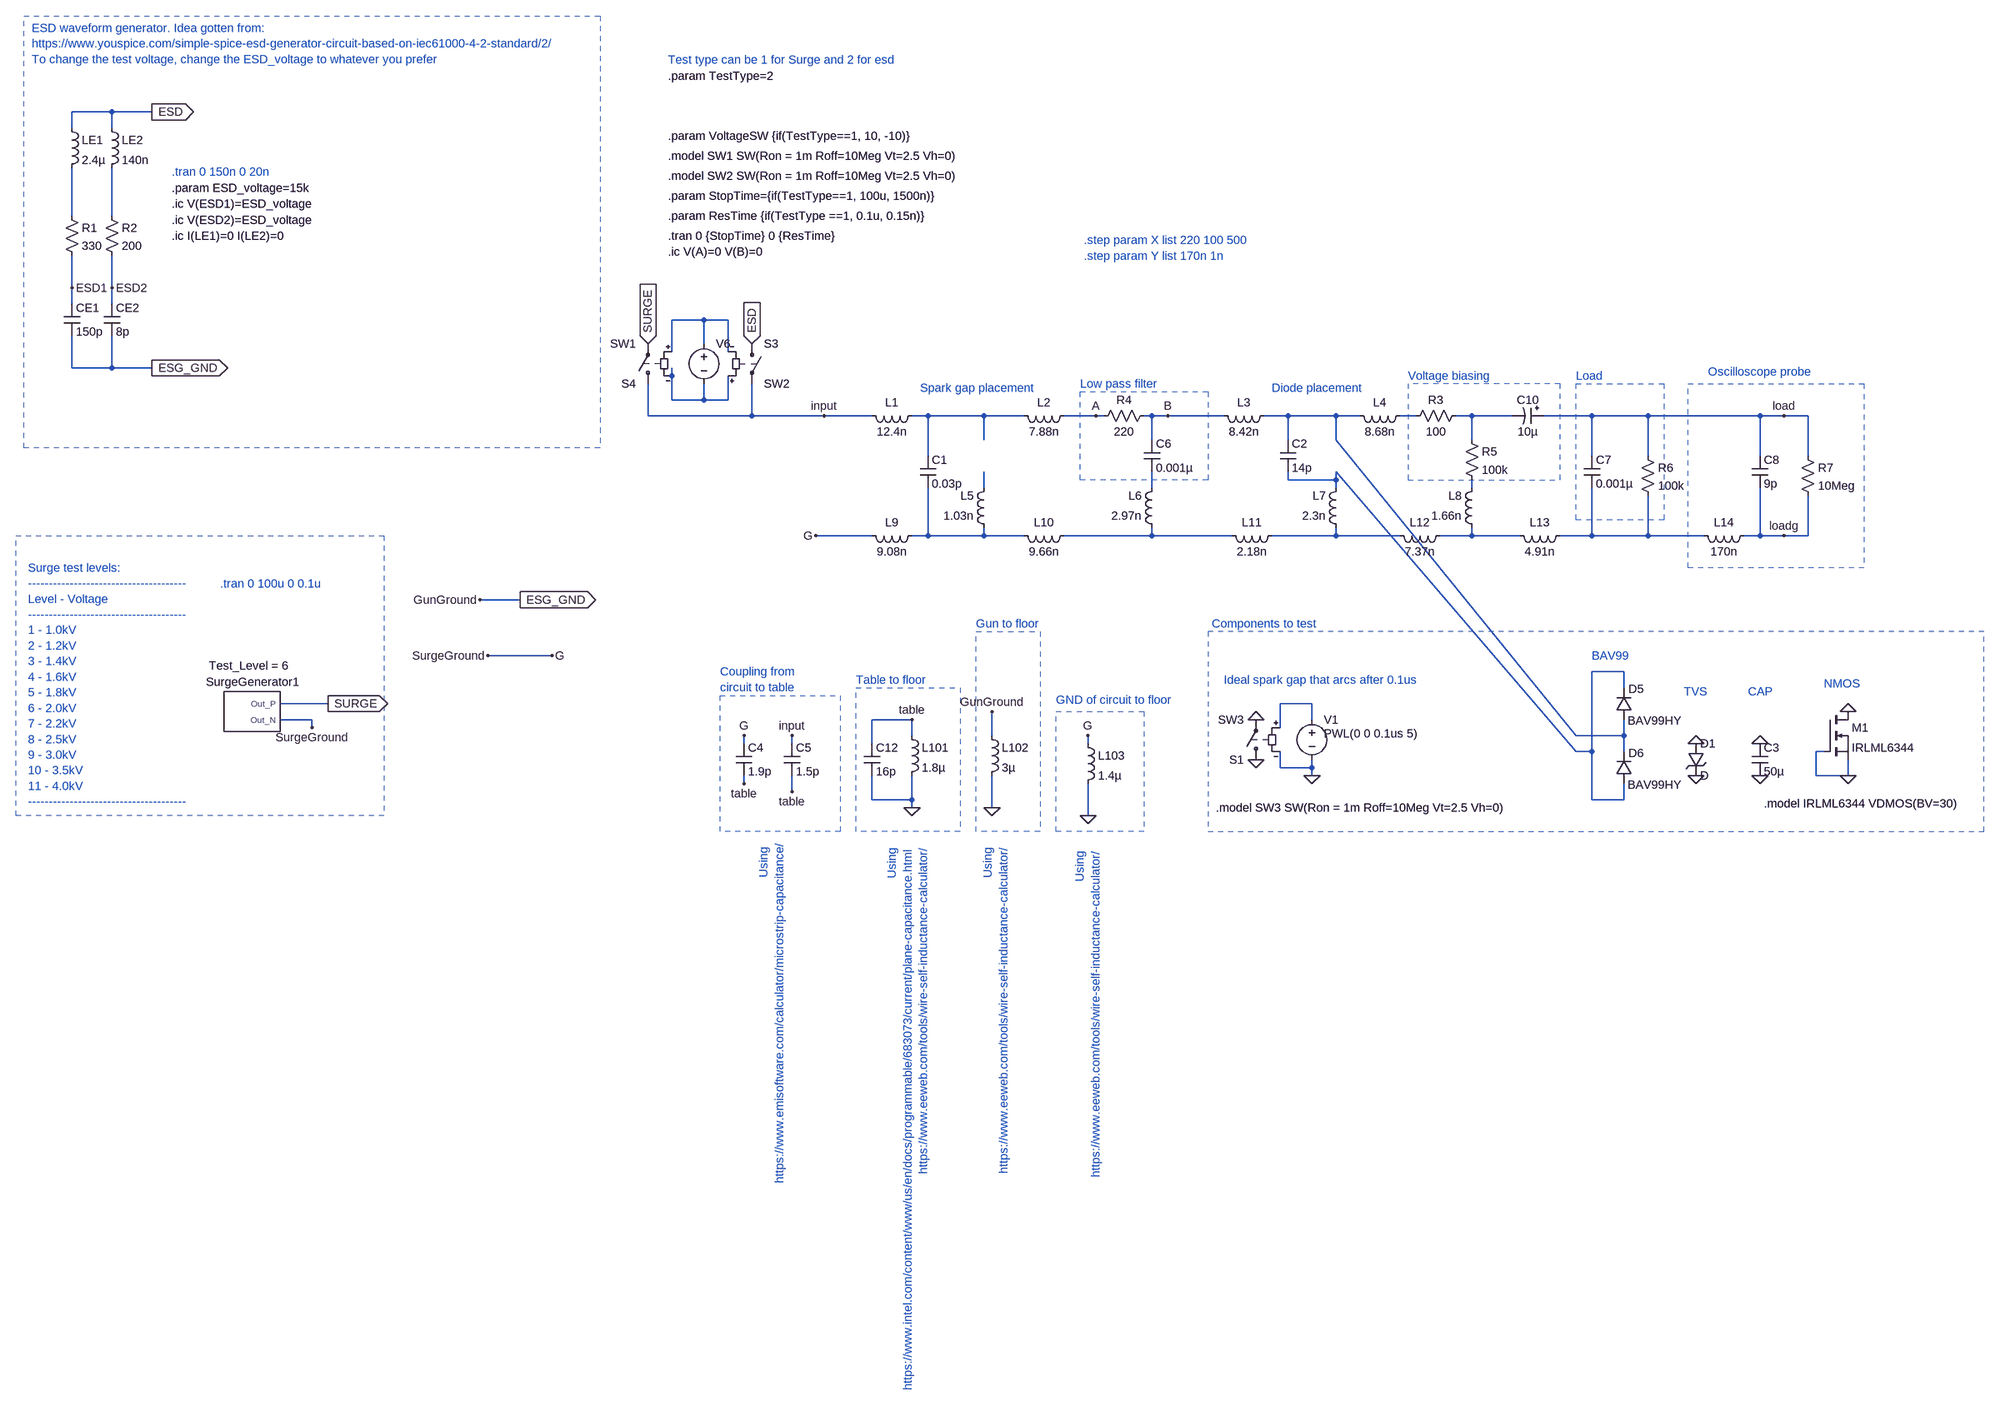
[diagram p0: schematic comparison.asc]
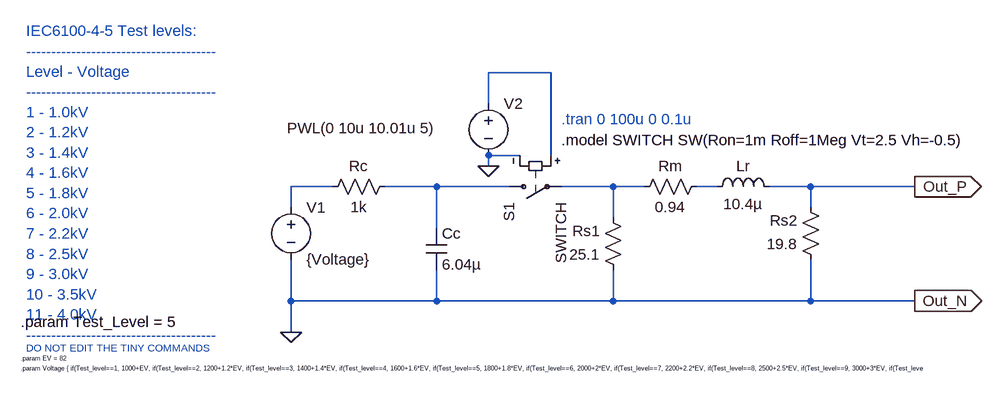
[diagram p1: sub-circuit surgetester.asc]
comparison.asc, the LTspice schematic file:
Version 4
SHEET 1 2900 2376
WIRE -848 -368 -928 -368
WIRE -768 -368 -848 -368
WIRE -928 -336 -928 -368
WIRE -848 -336 -848 -368
WIRE -928 -160 -928 -256
WIRE -848 -160 -848 -256
WIRE -928 -16 -928 -80
WIRE -848 -16 -848 -80
WIRE -928 16 -928 -16
WIRE -848 16 -848 -16
WIRE 336 48 272 48
WIRE 384 48 336 48
WIRE 336 96 336 48
WIRE 272 112 272 48
WIRE 384 112 384 48
WIRE -928 144 -928 80
WIRE -848 144 -848 80
WIRE -848 144 -928 144
WIRE -768 144 -848 144
WIRE 272 160 272 144
WIRE 272 208 272 160
WIRE 336 208 336 176
WIRE 336 208 272 208
WIRE 384 208 384 160
WIRE 384 208 336 208
WIRE 224 240 224 176
WIRE 432 240 432 176
WIRE 432 240 224 240
WIRE 576 240 432 240
WIRE 672 240 576 240
WIRE 784 240 752 240
WIRE 896 240 784 240
WIRE 976 240 896 240
WIRE 1120 240 1056 240
WIRE 1136 240 1120 240
WIRE 1232 240 1216 240
WIRE 1264 240 1232 240
WIRE 1376 240 1264 240
WIRE 1504 240 1456 240
WIRE 1600 240 1504 240
WIRE 1648 240 1600 240
WIRE 1760 240 1728 240
WIRE 1872 240 1840 240
WIRE 1952 240 1872 240
WIRE 2112 240 2016 240
WIRE 2224 240 2112 240
WIRE 2448 240 2224 240
WIRE 2496 240 2448 240
WIRE 2544 240 2496 240
WIRE 896 288 896 240
WIRE 1232 288 1232 240
WIRE 1504 288 1504 240
WIRE 1600 288 1600 240
WIRE 1872 288 1872 240
WIRE 784 320 784 240
WIRE 2112 320 2112 240
WIRE 2224 320 2224 240
WIRE 2448 320 2448 240
WIRE 2544 320 2544 240
WIRE 1504 368 1504 352
WIRE 1600 368 1600 352
WIRE 1600 368 1504 368
WIRE 896 384 896 352
WIRE 1232 384 1232 352
WIRE 1600 384 1600 368
WIRE 1872 384 1872 368
WIRE 672 480 560 480
WIRE 784 480 784 384
WIRE 784 480 752 480
WIRE 896 480 896 464
WIRE 896 480 784 480
WIRE 976 480 896 480
WIRE 1232 480 1232 464
WIRE 1232 480 1056 480
WIRE 1392 480 1232 480
WIRE 1600 480 1600 464
WIRE 1600 480 1472 480
WIRE 1728 480 1600 480
WIRE 1872 480 1872 464
WIRE 1872 480 1808 480
WIRE 1968 480 1872 480
WIRE 2112 480 2112 384
WIRE 2112 480 2048 480
WIRE 2224 480 2224 400
WIRE 2224 480 2112 480
WIRE 2336 480 2224 480
WIRE 2448 480 2448 384
WIRE 2448 480 2416 480
WIRE 2496 480 2448 480
WIRE 2544 480 2544 400
WIRE 2544 480 2496 480
WIRE -32 608 -112 608
WIRE 32 720 -96 720
WIRE 2176 752 2112 752
WIRE 2176 784 2176 752
WIRE -416 816 -512 816
WIRE 1552 816 1488 816
WIRE -448 848 -512 848
WIRE 752 848 672 848
WIRE 1552 848 1552 816
WIRE -448 864 -448 848
WIRE 1488 864 1488 816
WIRE 752 880 752 848
WIRE 912 880 912 832
WIRE 2080 880 1600 288
WIRE 2176 880 2176 848
WIRE 2176 880 2080 880
WIRE 416 896 416 880
WIRE 512 896 512 880
WIRE 672 896 672 848
WIRE 1104 896 1104 880
WIRE 2080 912 1600 352
WIRE 2112 912 2112 752
WIRE 2112 912 2080 912
WIRE 2176 912 2176 880
WIRE 2576 912 2560 912
WIRE 1488 944 1488 912
WIRE 1552 944 1552 928
WIRE 1552 944 1488 944
WIRE 1552 960 1552 944
WIRE 2560 960 2560 912
WIRE 2624 960 2624 928
WIRE 2624 960 2560 960
WIRE 416 976 416 960
WIRE 512 992 512 960
WIRE 672 1008 672 960
WIRE 752 1008 752 960
WIRE 752 1008 672 1008
WIRE 2112 1008 2112 912
WIRE 2176 1008 2176 976
WIRE 2176 1008 2112 1008
WIRE 752 1024 752 1008
WIRE 912 1024 912 960
WIRE 1104 1040 1104 976
FLAG -768 -368 ESD
IOPIN -768 -368 Out
FLAG -928 -16 ESD1
FLAG -848 -16 ESD2
FLAG -416 816 SURGE
IOPIN -416 816 Out
FLAG 912 832 GunGround
FLAG 416 880 G
FLAG 432 96 ESD
IOPIN 432 96 In
FLAG 1120 240 A
FLAG 1264 240 B
FLAG 2496 240 load
FLAG 224 96 SURGE
IOPIN 224 96 In
FLAG -448 864 SurgeGround
FLAG 512 992 table
FLAG 416 976 table
FLAG 1104 880 G
FLAG 752 848 table
FLAG 912 1024 0
FLAG 1104 1040 0
FLAG 752 1024 0
FLAG -768 144 ESG_GND
IOPIN -768 144 Out
FLAG -32 608 ESG_GND
IOPIN -32 608 Out
FLAG -112 608 GunGround
FLAG 1552 960 0
FLAG 560 480 G
FLAG 2496 480 loadg
FLAG 2320 960 0
FLAG 2448 960 0
FLAG 2624 960 0
FLAG 2320 896 0
FLAG 2448 896 0
FLAG 2624 832 0
FLAG 1440 928 0
FLAG 1440 848 0
FLAG 576 240 input
FLAG 512 880 input
FLAG -96 720 SurgeGround
FLAG 32 720 G
SYMBOL cap -944 16 R0
SYMATTR InstName CE1
SYMATTR Value 150p
SYMBOL cap -864 16 R0
SYMATTR InstName CE2
SYMATTR Value 8p
SYMBOL res -944 -176 R0
SYMATTR InstName R1
SYMATTR Value 330
SYMBOL res -864 -176 R0
SYMATTR InstName R2
SYMATTR Value 200
SYMBOL ind -944 -352 R0
SYMATTR InstName LE1
SYMATTR Value 2.4µ
SYMBOL ind -864 -352 R0
SYMATTR InstName LE2
SYMATTR Value 140n
SYMBOL SurgeTester -576 832 R0
WINDOW 39 2 -76 Bottom 2
SYMATTR SpiceLine Test_Level = 6
SYMATTR InstName SurgeGenerator1
SYMBOL res 1120 256 R270
WINDOW 0 32 56 VTop 2
WINDOW 3 0 56 VBottom 2
SYMATTR InstName R4
SYMATTR Value 220
SYMATTR SpiceLine tol=1 pwr=100m
SYMBOL diode 2192 976 R180
WINDOW 0 -24 61 Left 2
WINDOW 3 -99 -2 Left 2
SYMATTR InstName D6
SYMATTR Value BAV99HY
SYMBOL cap 1216 288 R0
SYMATTR InstName C6
SYMATTR Value 0.001µ
SYMATTR SpiceLine V=50 Irms=0 Rser=0.2578 Lser=410p mfg="W�rth Elektronik" pn="885012206083R WCAP-CSGP 0603" type="X7R"
SYMBOL res 2208 304 R0
SYMATTR InstName R6
SYMATTR Value 100k
SYMBOL ind 768 224 R90
WINDOW 0 5 56 VBottom 2
WINDOW 3 32 56 VTop 2
SYMATTR InstName L1
SYMATTR Value 12.4n
SYMBOL ind 1472 224 R90
WINDOW 0 5 56 VBottom 2
WINDOW 3 32 56 VTop 2
SYMATTR InstName L3
SYMATTR Value 8.42n
SYMBOL cap 768 320 R0
SYMATTR InstName C1
SYMATTR Value 0.03p
SYMBOL cap 1488 288 R0
SYMATTR InstName C2
SYMATTR Value 14p
SYMBOL polcap 2016 224 R90
WINDOW 0 0 32 VBottom 2
WINDOW 3 32 32 VTop 2
SYMATTR InstName C10
SYMATTR Value 10µ
SYMBOL sw 432 80 R0
SYMATTR InstName S3
SYMATTR Value SW2
SYMBOL sw 224 192 R180
SYMATTR InstName S4
SYMATTR Value SW1
SYMBOL voltage 336 80 R0
WINDOW 3 24 96 Invisible 1
WINDOW 123 0 0 Left 0
WINDOW 39 0 0 Left 0
SYMATTR Value {VoltageSW}
SYMATTR InstName V6
SYMBOL diode 2192 848 R180
WINDOW 0 -24 61 Left 2
WINDOW 3 -99 -2 Left 2
SYMATTR InstName D5
SYMATTR Value BAV99HY
SYMBOL nmos 2576 832 R0
SYMATTR InstName M1
SYMATTR Value IRLML6344
SYMBOL TVSdiode 2304 896 R0
SYMATTR InstName D1
SYMBOL cap 2432 896 R0
SYMATTR InstName C3
SYMATTR Value 50µ
SYMBOL ind 1088 880 R0
SYMATTR InstName L103
SYMATTR Value 1.4µ
SYMATTR SpiceLine Rser=0.03
SYMBOL res 1856 224 R90
WINDOW 0 0 56 VBottom 2
WINDOW 3 32 56 VTop 2
SYMATTR InstName R3
SYMATTR Value 100
SYMBOL res 1856 272 R0
SYMATTR InstName R5
SYMATTR Value 100k
SYMBOL cap 2096 320 R0
SYMATTR InstName C7
SYMATTR Value 0.001µ
SYMATTR SpiceLine V=10 Irms=0 Rser=0.2496 Lser=404p mfg="W�rth Elektronik" pn="885012206008 WCAP-CSGP 0603" type="X7R"
SYMBOL cap 400 896 R0
SYMATTR InstName C4
SYMATTR Value 1.9p
SYMBOL ind 736 864 R0
SYMATTR InstName L101
SYMATTR Value 1.8µ
SYMATTR SpiceLine Rser=0.12
SYMBOL ind 896 864 R0
SYMATTR InstName L102
SYMATTR Value 3µ
SYMATTR SpiceLine Rser=0.081
SYMBOL cap 496 896 R0
SYMATTR InstName C5
SYMATTR Value 1.5p
SYMBOL cap 656 896 R0
SYMATTR InstName C12
SYMATTR Value 16p
SYMBOL sw 1440 944 R180
SYMATTR InstName S1
SYMATTR Value SW3
SYMBOL voltage 1552 832 R0
WINDOW 3 24 44 Left 2
WINDOW 123 0 0 Left 0
WINDOW 39 0 0 Left 0
SYMATTR Value PWL(0 0 0.1us 5)
SYMATTR InstName V1
SYMBOL ind 768 464 R90
WINDOW 0 5 56 VBottom 2
WINDOW 3 32 56 VTop 2
SYMATTR InstName L9
SYMATTR Value 9.08n
SYMBOL ind 1488 464 R90
WINDOW 0 5 56 VBottom 2
WINDOW 3 32 56 VTop 2
SYMATTR InstName L11
SYMATTR Value 2.18n
SYMBOL ind 2064 464 R90
WINDOW 0 5 56 VBottom 2
WINDOW 3 32 56 VTop 2
SYMATTR InstName L13
SYMATTR Value 4.91n
SYMBOL ind 1072 224 R90
WINDOW 0 5 56 VBottom 2
WINDOW 3 32 56 VTop 2
SYMATTR InstName L2
SYMATTR Value 7.88n
SYMBOL ind 1072 464 R90
WINDOW 0 5 56 VBottom 2
WINDOW 3 32 56 VTop 2
SYMATTR InstName L10
SYMATTR Value 9.66n
SYMBOL ind 912 480 R180
WINDOW 0 36 80 Left 2
WINDOW 3 36 40 Left 2
SYMATTR InstName L5
SYMATTR Value 1.03n
SYMBOL ind 1248 480 R180
WINDOW 0 36 80 Left 2
WINDOW 3 36 40 Left 2
SYMATTR InstName L6
SYMATTR Value 2.97n
SYMBOL ind 1616 480 R180
WINDOW 0 36 80 Left 2
WINDOW 3 36 40 Left 2
SYMATTR InstName L7
SYMATTR Value 2.3n
SYMBOL ind 1888 480 R180
WINDOW 0 36 80 Left 2
WINDOW 3 36 40 Left 2
SYMATTR InstName L8
SYMATTR Value 1.66n
SYMBOL ind 1824 464 R90
WINDOW 0 5 56 VBottom 2
WINDOW 3 32 56 VTop 2
SYMATTR InstName L12
SYMATTR Value 7.37n
SYMBOL ind 1744 224 R90
WINDOW 0 5 56 VBottom 2
WINDOW 3 32 56 VTop 2
SYMATTR InstName L4
SYMATTR Value 8.68n
SYMBOL cap 2432 320 R0
SYMATTR InstName C8
SYMATTR Value 9p
SYMBOL res 2528 304 R0
SYMATTR InstName R7
SYMATTR Value 10Meg
SYMBOL ind 2432 464 R90
WINDOW 0 5 56 VBottom 2
WINDOW 3 32 56 VTop 2
SYMATTR InstName L14
SYMATTR Value 170n
TEXT -728 -184 Left 2 !.ic V(ESD1)=ESD_voltage
TEXT -728 -248 Left 2 ;.tran 0 150n 0 20n
TEXT -728 -216 Left 2 !.param ESD_voltage=15k
TEXT -1008 -536 Left 2 ;ESD waveform generator. Idea gotten from:\nhttps://www.youspice.com/simple-spice-esd-generator-circuit-based-on-iec61000-4-2-standard/2/\nTo change the test voltage, change the ESD_voltage to whatever you prefer
TEXT -1016 544 Left 2 ;Surge test levels:\n--------------------------------------\nLevel - Voltage\n--------------------------------------\n1 - 1.0kV\n2 - 1.2kV\n3 - 1.4kV\n4 - 1.6kV\n5 - 1.8kV\n6 - 2.0kV\n7 - 2.2kV\n8 - 2.5kV\n9 - 3.0kV\n10 - 3.5kV\n11 - 4.0kV\n--------------------------------------
TEXT -632 576 Left 2 ;.tran 0 100u 0 0.1u
TEXT 264 -440 Left 2 !.param TestType=2
TEXT 264 -472 Left 2 ;Test type can be 1 for Surge and 2 for esd
TEXT 264 -320 Left 2 !.param VoltageSW {if(TestType==1, 10, -10)}
TEXT 264 -280 Left 2 !.model SW1 SW(Ron = 1m Roff=10Meg Vt=2.5 Vh=0)
TEXT 264 -240 Left 2 !.model SW2 SW(Ron = 1m Roff=10Meg Vt=2.5 Vh=0)
TEXT 264 -200 Left 2 !.param StopTime={if(TestType==1, 100u, 1500n)}
TEXT 264 -160 Left 2 !.param ResTime {if(TestType ==1, 0.1u, 0.15n)}
TEXT 264 -120 Left 2 !.tran 0 {StopTime} 0 {ResTime}
TEXT 1088 176 Left 2 ;Low pass filter
TEXT 768 184 Left 2 ;Spark gap placement
TEXT 2080 160 Left 2 ;Load
TEXT 2456 1016 Left 2 !.model IRLML6344 VDMOS(BV=30)
TEXT 264 -88 Left 2 !.ic V(A)=0 V(B)=0
TEXT 2344 152 Left 2 ;Oscilloscope probe
TEXT 368 752 Left 2 ;Coupling from \ncircuit to table
TEXT 640 768 Left 2 ;Table to floor
TEXT 880 656 Left 2 ;Gun to floor
TEXT 1040 808 Left 2 ;GND of circuit to floor
TEXT 1472 184 Left 2 ;Diode placement
TEXT 1096 -112 Left 2 ;.step param X list 220 100 500
TEXT -728 -120 Left 2 !.ic I(LE1)=0 I(LE2)=0
TEXT -728 -152 Left 2 !.ic V(ESD2)=ESD_voltage
TEXT 1360 1024 Left 2 !.model SW3 SW(Ron = 1m Roff=10Meg Vt=2.5 Vh=0)
TEXT 1744 160 Left 2 ;Voltage biasing
TEXT 1096 -80 Left 2 ;.step param Y list 170n 1n
TEXT 1352 656 Left 2 ;Components to test
TEXT 1376 768 Left 2 ;Ideal spark gap that arcs after 0.1us
TEXT 2112 720 Left 2 ;BAV99
TEXT 2296 792 Left 2 ;TVS
TEXT 2424 792 Left 2 ;CAP
TEXT 2576 776 Left 2 ;NMOS
TEXT 456 1096 VRight 2 ;Using \nhttps://www.emisoftware.com/calculator/microstrip-capacitance/
TEXT 712 1104 VRight 2 ;Using\nhttps://www.intel.com/content/www/us/en/docs/programmable/683073/current/plane-capacitance.html\nhttps://www.eeweb.com/tools/wire-self-inductance-calculator/
TEXT 904 1104 VRight 2 ;Using\nhttps://www.eeweb.com/tools/wire-self-inductance-calculator/
TEXT 1088 1112 VRight 2 ;Using\nhttps://www.eeweb.com/tools/wire-self-inductance-calculator/
RECTANGLE Normal 128 304 -1024 -560 2
RECTANGLE Normal -304 1040 -1040 480 2
RECTANGLE Normal 608 1072 368 800 2
RECTANGLE Normal 1216 1072 1040 832 2
RECTANGLE Normal 1008 1072 880 672 2
RECTANGLE Normal 1344 368 1088 192 2
RECTANGLE Normal 2080 176 2256 448 2
RECTANGLE Normal 1744 368 2048 176 2
RECTANGLE Normal 2656 544 2304 176 2
RECTANGLE Normal 2896 672 1344 1072 2
RECTANGLE Normal 848 1072 640 784 2

surgetester.asc, the sub-circuit schematic file:
Version 4
SHEET 1 4016 680
WIRE 336 -80 240 -80
WIRE 240 -32 240 -80
WIRE 288 48 240 48
WIRE 336 48 336 -80
WIRE 240 64 240 48
WIRE 0 96 -64 96
WIRE 160 96 80 96
WIRE 272 96 160 96
WIRE 432 96 352 96
WIRE 480 96 432 96
WIRE 592 96 560 96
WIRE 736 96 672 96
WIRE 896 96 736 96
WIRE -64 128 -64 96
WIRE 736 128 736 96
WIRE 432 144 432 96
WIRE 160 160 160 96
WIRE -64 272 -64 208
WIRE 160 272 160 224
WIRE 160 272 -64 272
WIRE 432 272 432 224
WIRE 432 272 160 272
WIRE 736 272 736 208
WIRE 736 272 432 272
WIRE 896 272 736 272
WIRE -64 320 -64 272
FLAG 240 64 0
FLAG -64 320 0
FLAG 896 96 Out_P
IOPIN 896 96 Out
FLAG 896 272 Out_N
IOPIN 896 272 Out
SYMBOL voltage -64 112 R0
WINDOW 123 0 0 Left 0
WINDOW 39 0 0 Left 0
SYMATTR InstName V1
SYMATTR Value {Voltage}
SYMBOL voltage 240 -48 R0
WINDOW 3 -310 54 Left 2
WINDOW 123 0 0 Left 0
WINDOW 39 0 0 Left 0
SYMATTR InstName V2
SYMATTR Value PWL(0 10u 10.01u 5)
SYMBOL res 96 80 R90
WINDOW 0 0 56 VBottom 2
WINDOW 3 32 56 VTop 2
SYMATTR InstName Rc
SYMATTR Value 1k
SYMBOL res 576 80 R90
WINDOW 0 0 56 VBottom 2
WINDOW 3 32 56 VTop 2
SYMATTR InstName Rm
SYMATTR Value 0.94
SYMBOL res 448 240 R180
WINDOW 0 36 76 Left 2
WINDOW 3 36 40 Left 2
SYMATTR InstName Rs1
SYMATTR Value 25.1
SYMBOL res 752 224 R180
WINDOW 0 36 76 Left 2
WINDOW 3 36 40 Left 2
SYMATTR InstName Rs2
SYMATTR Value 19.8
SYMBOL sw 256 96 M90
SYMATTR InstName S1
SYMATTR Value SWITCH
SYMBOL cap 144 160 R0
SYMATTR InstName Cc
SYMATTR Value 6.04µ
SYMBOL ind 576 112 R270
WINDOW 0 32 56 VTop 2
WINDOW 3 5 56 VBottom 2
SYMATTR InstName Lr
SYMATTR Value 10.4µ
TEXT 352 24 Left 2 !.model SWITCH SW(Ron=1m Roff=1Meg Vt=2.5 Vh=-0.5)
TEXT 352 -8 Left 2 ;.tran 0 100u 0 0.1u
TEXT -472 -144 Left 2 ;IEC6100-4-5 Test levels:\n--------------------------------------\nLevel - Voltage\n--------------------------------------\n1 - 1.0kV\n2 - 1.2kV\n3 - 1.4kV\n4 - 1.6kV\n5 - 1.8kV\n6 - 2.0kV\n7 - 2.2kV\n8 - 2.5kV\n9 - 3.0kV\n10 - 3.5kV\n11 - 4.0kV\n--------------------------------------
TEXT -480 304 Left 2 !.param Test_Level = 5
TEXT -480 376 Left 0 !.param Voltage { if(Test_level==1, 1000+EV, if(Test_level==2, 1200+1.2*EV, if(Test_level==3, 1400+1.4*EV, if(Test_level==4, 1600+1.6*EV, if(Test_level==5, 1800+1.8*EV, if(Test_level==6, 2000+2*EV, if(Test_level==7, 2200+2.2*EV, if(Test_level==8, 2500+2.5*EV, if(Test_level==9, 3000+3*EV, if(Test_level==10, 3500+3.5*EV, if(Test_level==11, 4000+4*EV, 0)))))))))))}
TEXT -480 360 Left 0 !.param EV = 82
TEXT -472 344 Left 1 ;DO NOT EDIT THE TINY COMMANDS

The netlist it stands for:
* comparison.asc
CE1 ESD1 ESG_GND 150p
CE2 ESD2 ESG_GND 8p
R1 N001 ESD1 330
R2 N002 ESD2 200
LE1 ESD N001 2.4µ
LE2 ESD N002 140n
XSurgeGenerator1 SurgeGround SURGE surgetester params: Test_Level = 6
R4 A B 220 tol=1 pwr=100m
D6 N009 N006 BAV99HY
C6 B N011 0.001µ V=50 Irms=0 Rser=0.2578 Lser=410p mfg="W�rth Elektronik" pn="885012206083R WCAP-CSGP 0603" type="X7R"
R6 load N017 100k
L1 N005 input 12.4n
L3 N006 B 8.42n
C1 N005 N013 0.03p
C2 N006 N009 14p
C10 load N008 10µ
S3 ESD input N004 N003 SW2
S4 input SURGE N003 N004 SW1
V6 N003 N004 {VoltageSW}
D5 N006 N009 BAV99HY
M1 0 0 0 0 IRLML6344
D1 0 0 D
C3 0 0 50µ
L103 SurgeGround 0 1.4µ Rser=0.03
R3 N008 N007 100
R5 N008 N012 100k
C7 load N017 0.001µ V=10 Irms=0 Rser=0.2496 Lser=404p mfg="W�rth Elektronik" pn="885012206008 WCAP-CSGP 0603" type="X7R"
C4 SurgeGround table 1.9p
L101 table 0 1.8µ Rser=0.12
L102 ESG_GND 0 3µ Rser=0.081
C5 input table 1.5p
C12 table 0 16p
S1 0 0 N018 0 SW3
V1 N018 0 PWL(0 0 0.1us 5)
L9 N013 SurgeGround 9.08n
L11 N015 N014 2.18n
L13 N017 N016 4.91n
L2 A N005 7.88n
L10 N014 N013 9.66n
L5 N013 N010 1.03n
L6 N014 N011 2.97n
L7 N015 N009 2.3n
L8 N016 N012 1.66n
L12 N016 N015 7.37n
L4 N007 N006 8.68n
C8 load loadg 9p
R7 load loadg 10Meg
L14 loadg N017 170n

* block symbol definitions
.subckt surgetester Out_N Out_P
V1 N002 0 {Voltage}
V2 N001 0 PWL(0 10u 10.01u 5)
Rc N003 N002 1k
Rm N005 N004 0.94
Rs1 0 N004 25.1
Rs2 0 Out_P 19.8
S1 N003 N004 N001 0 SWITCH
Cc N003 0 6.04µ
Lr N005 Out_P 10.4µ
.model SWITCH SW(Ron=1m Roff=1Meg Vt=2.5 Vh=-0.5)
* .tran 0 100u 0 0.1u
* IEC6100-4-5 Test levels:
* --------------------------------------
* Level - Voltage
* --------------------------------------
* 1 - 1.0kV
* 2 - 1.2kV
* 3 - 1.4kV
* 4 - 1.6kV
* 5 - 1.8kV
* 6 - 2.0kV
* 7 - 2.2kV
* 8 - 2.5kV
* 9 - 3.0kV
* 10 - 3.5kV
* 11 - 4.0kV
* --------------------------------------
.param Test_Level = 5
.param Voltage { if(Test_level==1, 1000+EV, if(Test_level==2, 1200+1.2*EV, if(Test_level==3, 1400+1.4*EV, if(Test_level==4, 1600+1.6*EV, if(Test_level==5, 1800+1.8*EV, if(Test_level==6, 2000+2*EV, if(Test_level==7, 2200+2.2*EV, if(Test_level==8, 2500+2.5*EV, if(Test_level==9, 3000+3*EV, if(Test_level==10, 3500+3.5*EV, if(Test_level==11, 4000+4*EV, 0)))))))))))}
.param EV = 82
* DO NOT EDIT THE TINY COMMANDS
.ends surgetester

.model D D
.lib standard.dio
.model NMOS NMOS
.model PMOS PMOS
.lib standard.mos
.ic V(ESD1)=ESD_voltage
* .tran 0 150n 0 20n
.param ESD_voltage=15k
* ESD waveform generator. Idea gotten from:
* https://www.youspice.com/simple-spice-esd-generator-circuit-based-on-iec61000-4-2-standard/2/
* To change the test voltage, change the ESD_voltage to whatever you prefer
* Surge test levels:
* --------------------------------------
* Level - Voltage
* --------------------------------------
* 1 - 1.0kV
* 2 - 1.2kV
* 3 - 1.4kV
* 4 - 1.6kV
* 5 - 1.8kV
* 6 - 2.0kV
* 7 - 2.2kV
* 8 - 2.5kV
* 9 - 3.0kV
* 10 - 3.5kV
* 11 - 4.0kV
* --------------------------------------
* .tran 0 100u 0 0.1u
.param TestType=2
* Test type can be 1 for Surge and 2 for esd
.param VoltageSW {if(TestType==1, 10, -10)}
.model SW1 SW(Ron = 1m Roff=10Meg Vt=2.5 Vh=0)
.model SW2 SW(Ron = 1m Roff=10Meg Vt=2.5 Vh=0)
.param StopTime={if(TestType==1, 100u, 1500n)}
.param ResTime {if(TestType ==1, 0.1u, 0.15n)}
.tran 0 {StopTime} 0 {ResTime}
* Low pass filter
* Spark gap placement
* Load
.model IRLML6344 VDMOS(BV=30)
.ic V(A)=0 V(B)=0
* Oscilloscope probe
* Coupling from
* circuit to table
* Table to floor
* Gun to floor
* GND of circuit to floor
* Diode placement
* .step param X list 220 100 500
.ic I(LE1)=0 I(LE2)=0
.ic V(ESD2)=ESD_voltage
.model SW3 SW(Ron = 1m Roff=10Meg Vt=2.5 Vh=0)
* Voltage biasing
* .step param Y list 170n 1n
* Components to test
* Ideal spark gap that arcs after 0.1us
* BAV99
* TVS
* CAP
* NMOS
* Using
* https://www.emisoftware.com/calculator/microstrip-capacitance/
* Using
* https://www.intel.com/content/www/us/en/docs/programmable/683073/current/plane-capacitance.html
* https://www.eeweb.com/tools/wire-self-inductance-calculator/
* Using
* https://www.eeweb.com/tools/wire-self-inductance-calculator/
* Using
* https://www.eeweb.com/tools/wire-self-inductance-calculator/
.backanno
.end